# EAGLE design test_saving (EAGLE 7.2.0)
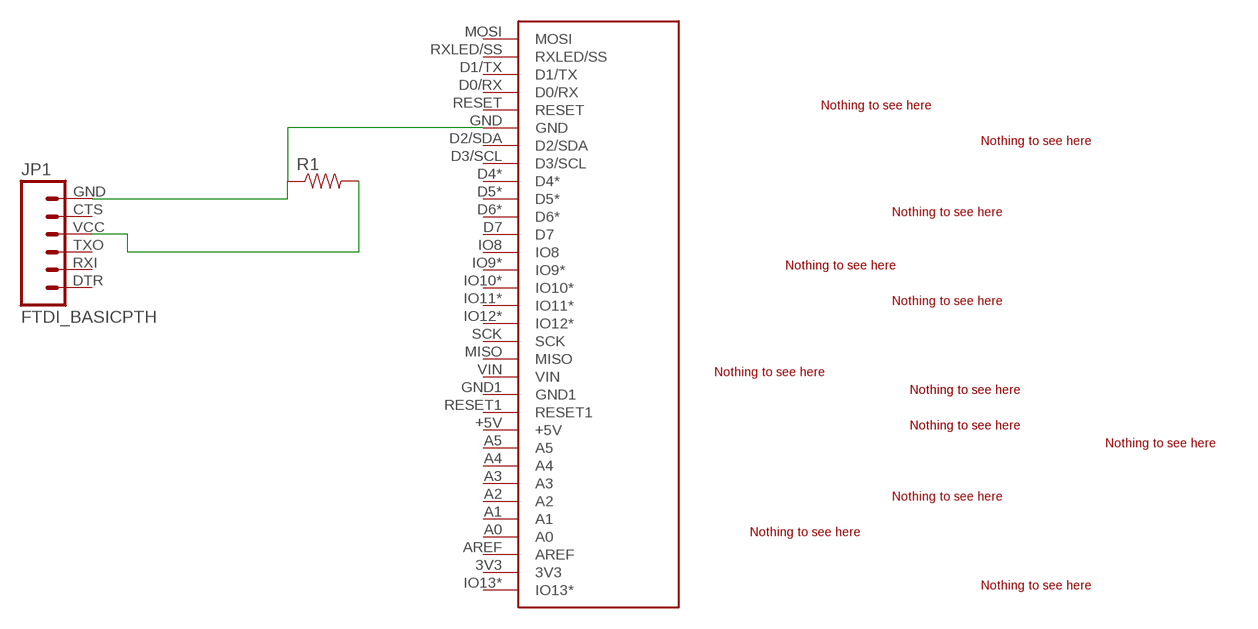
[diagram p0: schematic, sheet 1]

## Parts
ARDUINO  ARDUINO_MICRO_REV03J-BOB  [ARDUINO_MICRO_REV03J]
JP1  FTDI_BASICPTH  [FTDI_BASIC]
R1  RESISTOR0805-RES  [0805]
TEST-ARC1  TEST-ARC  [TEST-ARC]
TEST-ARC3  TEST-ARC3  [TEST-ARC3]
TEST-CIRCLE  TEST-CIRCLE  [TEST-CIRCLE]
TEST-HOLE  TEST-HOLE  [TEST-HOLE]
TEST-PAD1  TEST-PAD1  [TEST-PAD1]
TEST-PAD2  TEST-PAD2  [TEST-PAD2]
TEST-PAD-OCT  TEST-PAD-OCT  [TEST-PAD-OCT]
TEST-PAD-OCT2  TEST-PAD-OCT2  [TEST-PAD-OCT2]
TEST-PAD-ROT  TEST-PAD-ROT  [TEST-PAD-ROT]
TEST-PAD-ROUND  TEST-PAD-ROUND  [TEST-PAD-ROUND]
TEST-PAD-SQUARE  TEST-PAD3  [TEST-PAD3]
TEST-PAD-SQUARE-ROT  TEST-PAD-SQUARE-ROT  [TEST-PAD-SQUARE-ROT]

## Nets
N$1: ARDUINO.GND JP1.GND R1.1
N$2: JP1.VCC R1.2
Unconnected: ARDUINO.3V3 ARDUINO.+5V ARDUINO.A0 ARDUINO.A1 ARDUINO.A2 ARDUINO.A3 ARDUINO.A4 ARDUINO.A5 ARDUINO.AREF ARDUINO.D0/RX ARDUINO.D1/TX ARDUINO.D2/SDA ARDUINO.D3/SCL ARDUINO.D4* ARDUINO.D5* ARDUINO.D6* ARDUINO.D7 ARDUINO.GND1 ARDUINO.IO8 ARDUINO.IO9* ARDUINO.IO10* ARDUINO.IO11* ARDUINO.IO12* ARDUINO.IO13* ARDUINO.MISO ARDUINO.MOSI ARDUINO.RESET ARDUINO.RESET1 ARDUINO.RXLED/SS ARDUINO.SCK ARDUINO.VIN JP1.CTS JP1.DTR JP1.RXI JP1.TXO

## Library data of the parts
ARDUINO = BOBs:ARDUINO_MICRO_REV03J: Arduino Micro with Headers - 5V 16MHz
JP1 = SparkFun-Connectors:FTDI_BASIC: FTDI Basic header with labels
R1 = SparkFun-Passives:RESISTOR: Resistor Basic schematic elements and footprints for 0603, 1206, and PTH resistors.
TEST-ARC1 = Swoop-Test-Packages:TEST-ARC
TEST-ARC3 = Swoop-Test-Packages:TEST-ARC3
TEST-CIRCLE = Swoop-Test-Packages:TEST-CIRCLE
TEST-HOLE = Swoop-Test-Packages:TEST-HOLE
TEST-PAD1 = Swoop-Test-Packages:TEST-PAD1
TEST-PAD2 = Swoop-Test-Packages:TEST-PAD2
TEST-PAD-OCT = Swoop-Test-Packages:TEST-PAD-OCT
TEST-PAD-OCT2 = Swoop-Test-Packages:TEST-PAD-OCT2
TEST-PAD-ROT = Swoop-Test-Packages:TEST-PAD-ROT
TEST-PAD-ROUND = Swoop-Test-Packages:TEST-PAD-ROUND
TEST-PAD-SQUARE = Swoop-Test-Packages:TEST-PAD3
TEST-PAD-SQUARE-ROT = Swoop-Test-Packages:TEST-PAD-SQUARE-ROT

## Board
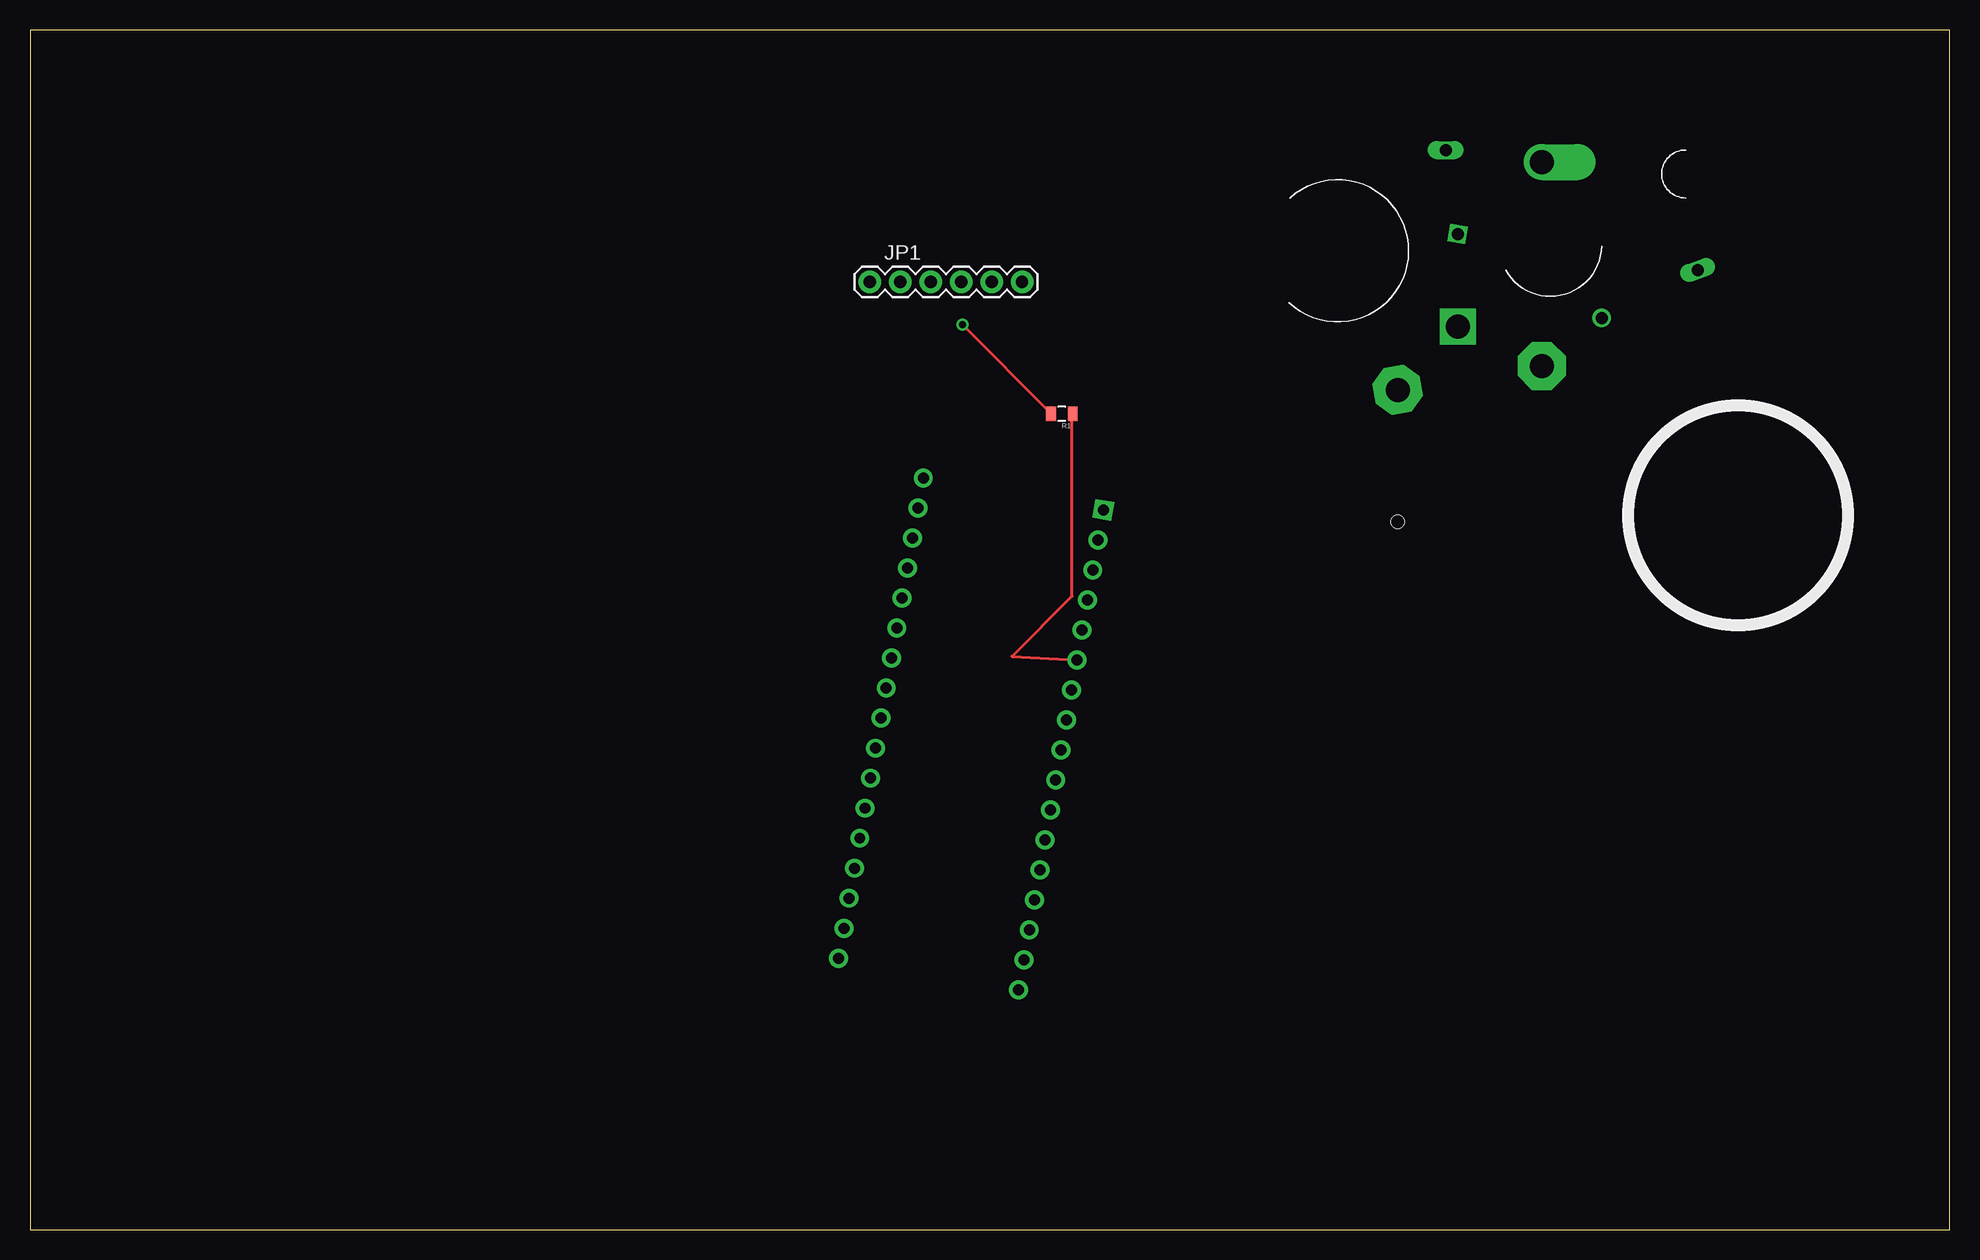
[diagram p1: board, top side]
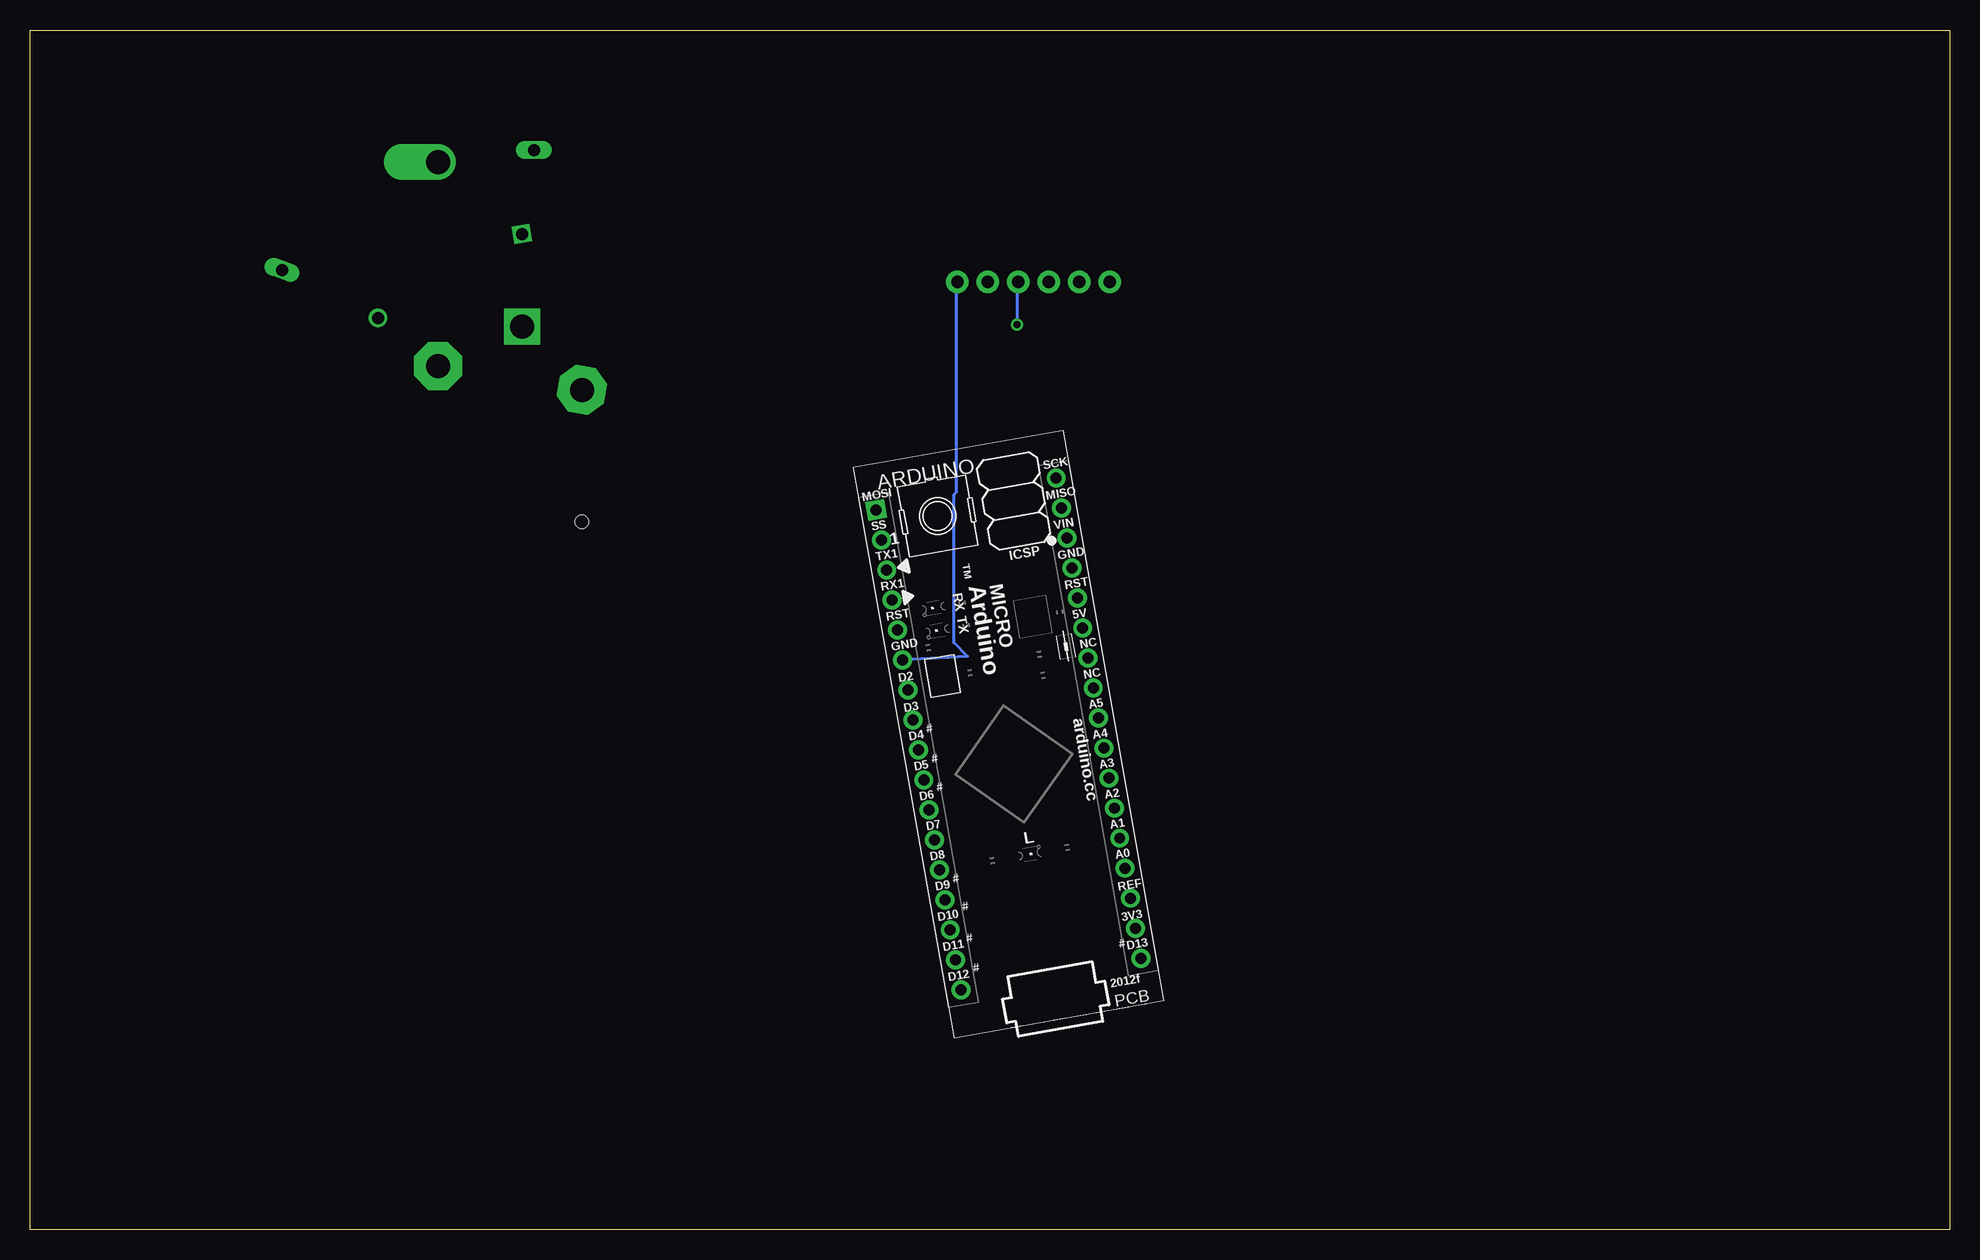
[diagram p2: board, bottom side, seen from below]

Size 160 x 100 mm. Coordinates in mm from the lower left corner, seen from the top.
Outline: 0,0 160,0 160,100 0,100 0,0
Copper layers (1*16): Top 0.035mm / dielectric 1.5mm / Bottom 0.035mm
Design rules "default *": minimum track width 10mil, minimum drill 24mil, track to track 8mil, track to pad 8mil, pad to pad 8mil, via to via 8mil, smd to smd 8mil, copper to edge 40mil, drill to drill 8mil, minimum pad ring 10mil, minimum via ring 8mil, stop-mask expansion 4mil, vias tented up to drill 0mil, thermal gap 10mil
tRestrict: area 67.3,77 to 86,81.2

### Footprints (pad centres in the part's own frame; a part is rotated, then mirrored left to right if it is on the bottom)
ARDUINO_MICRO_REV03J = drill 0.914 pad 1.575: 3V3 16.51,6.35; +5V 16.51,31.75; A0 16.51,11.43; A1 16.51,13.97; A2 16.51,16.51; A3 16.51,19.05; A4 16.51,21.59; A5 16.51,24.13; AREF 16.51,8.89; D0/RX 1.27,36.83; D1/TX 1.27,39.37; D2/SDA 1.27,29.21; D3/SCL 1.27,26.67; D4* 1.27,24.13; D5* 1.27,21.59; D6* 1.27,19.05; D7 1.27,16.51; GND 1.27,31.75; GND1 16.51,36.83; IO8 1.27,13.97; IO9* 1.27,11.43; IO10* 1.27,8.89; IO11* 1.27,6.35; IO12* 1.27,3.81; IO13* 16.51,3.81; J6.7 16.51,29.21; J6.8 16.51,26.67; MISO 16.51,41.91; RESET 1.27,34.29; RESET1 16.51,34.29; RXLED/SS 1.27,41.91; SCK 16.51,44.45; VIN 16.51,39.37 | drill 0.914 pad 1.575 square: MOSI 1.27,44.45
FTDI_BASIC = drill 1.016 pad 1.88: CTS 10.16,0; DTR 0,0; GND 12.7,0; RXI 2.54,0; TXO 5.08,0; VCC 7.62,0
0805 = smd 0.8 x 1.2: 1 -0.9,0; 2 0.9,0
TEST-HOLE = hole 1.1: -1,1
TEST-PAD1 = drill 2 offset: P$1 2,1
TEST-PAD2 = drill 1 long: P$1 0,0
TEST-PAD-OCT = drill 2 pad 4 octagon: P$1 0,0
TEST-PAD-OCT2 = drill 2 pad 4 octagon: P$1 0,0
TEST-PAD-ROT = drill 1 long: P$1 1,1
TEST-PAD-ROUND = drill 1: P$1 0,0
TEST-PAD3 = drill 2 square: P$1 0,1.27
TEST-PAD-SQUARE-ROT = drill 1 square: P$1 1,1

### Placement (x,y rotation side)
ARDUINO  83,16 10 bottom
JP1  70,79 0 top
R1  86,68 180 top
TEST-ARC1  105,82 0 top
TEST-ARC2  [TEST-ARC2]  131,82 0 top
TEST-ARC3  139,88 0 top
TEST-CIRCLE  150,57 0 top
TEST-HOLE  115,58 0 top
TEST-PAD1  124,88 0 top
TEST-PAD2  118,90 0 top
TEST-PAD-OCT  114,70 0 top
TEST-PAD-OCT2  126,72 0 top
TEST-PAD-ROT  138,79 0 top
TEST-PAD-ROUND  131,76 0 top
TEST-PAD-SQUARE  119,74 0 top
TEST-PAD-SQUARE-ROT  118,82 0 top

### Tracks (layer width: path | path; a pad name or v marks a point on that pad's centre or on a via)
N$1
  Top 0.254: R1.1 86.87,67.89 86.87,52.81 81.84,47.78 ARDUINO.GND
  Bottom 0.254: JP1.GND 82.75,78.87 82.75,61.49 82.98,61.27 82.98,48.92 81.84,47.78 ARDUINO.GND
N$2  (via drill 0.61)
  Top 0.254: v77.72,75.44 85.04,68.12 R1.2
  Bottom 0.254: v77.72,75.44 77.72,78.87 JP1.VCC